# EAGLE design VEML6030 (EAGLE 9.6.2)
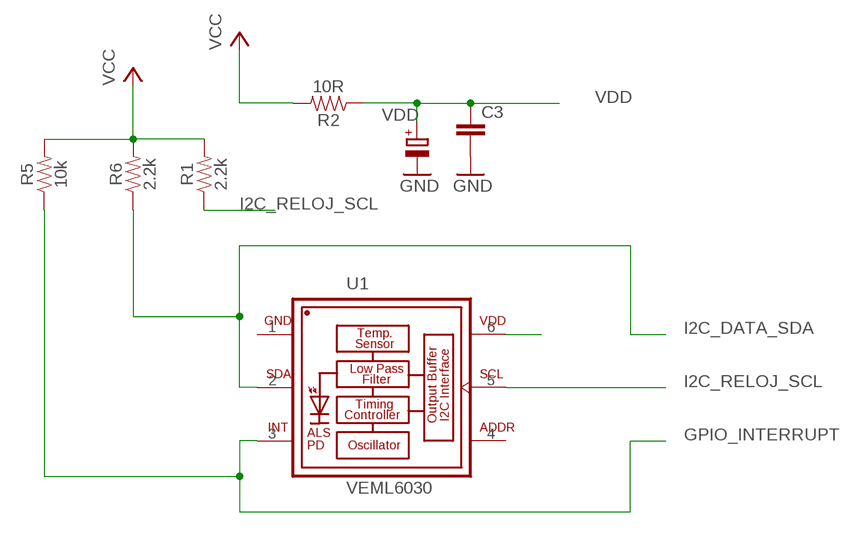
[diagram p0: schematic, sheet 1]

## Parts
C3  CAP-1206  [1206]
R1  2.2k  RESISTOR1206  [1206]
R2  10R  RESISTOR1206  [1206]
R5  10k  RESISTOR1206  [1206]
R6  2.2k  RESISTOR1206  [1206]
U1  VEML6030  [VISHAY_VEML6030_2X2X0.87]

## Nets
GND: C3.2
GPIO_INTERRUPT: R5.1 U1.3(INT)
I2C_DATA_SDA: R6.1 U1.2(SDA)
I2C_RELOJ_SCL: R1.1 U1.5(SCL)
N$1: R2.2
N$2: U1.6(VDD)
VCC: R1.2 R5.2 R6.2
VDD: C3.1 R2.1
Unconnected: U1.4(ADDR)

## Power pins joined to a net without a drawn wire
GND: U1.1(GND)

## Library data of the parts
C3 = SparkFun-Capacitors:CAP
R1 R2 R5 R6 = SparkFun-Resistors:RESISTOR: Generic Resistor Package
U1 = VEML6030:VEML6030: VEML6030 High Accuracy Ambient Light Sensor with I2C Interface: VEML6030 is a high accuracy ambient light digital 16-bit resolution sensor in a miniature transparent 2 mm x 2 mm package. It includes a high sensitive photodiode, a low noise amplifier, a 16-bit A/D converter and supports an easy to use I2C bus communication interface and additional interrupt feature. The ambient light result is as digital value available. Device Model created 15.06.2016 by Johannes Kolb - Vishay Semiconductor GmbH Check availability <https://pricing.snapeda.com/parts/VEML6030/Vishay/view-part?ref=eda>; AVAILABILITY: In Stock; CHECK_PRICES: https://www.snapeda.com/parts/VEML6030/Vishay+Semiconductor+Opto+Division/view-part/?ref=eda; DESCRIPTION: Optical Sensor Ambient 550nm I2C 6-SMD, No Lead; MF: Vishay; MP: VEML6030; PACKAGE: SMD-6 Vishay Semiconductor; PRICE: None; SNAPEDA_LINK: https://www.snapeda.com/parts/VEML6030/Vishay+Semiconductor+Opto+Division/view-part/?ref=snap

## Board
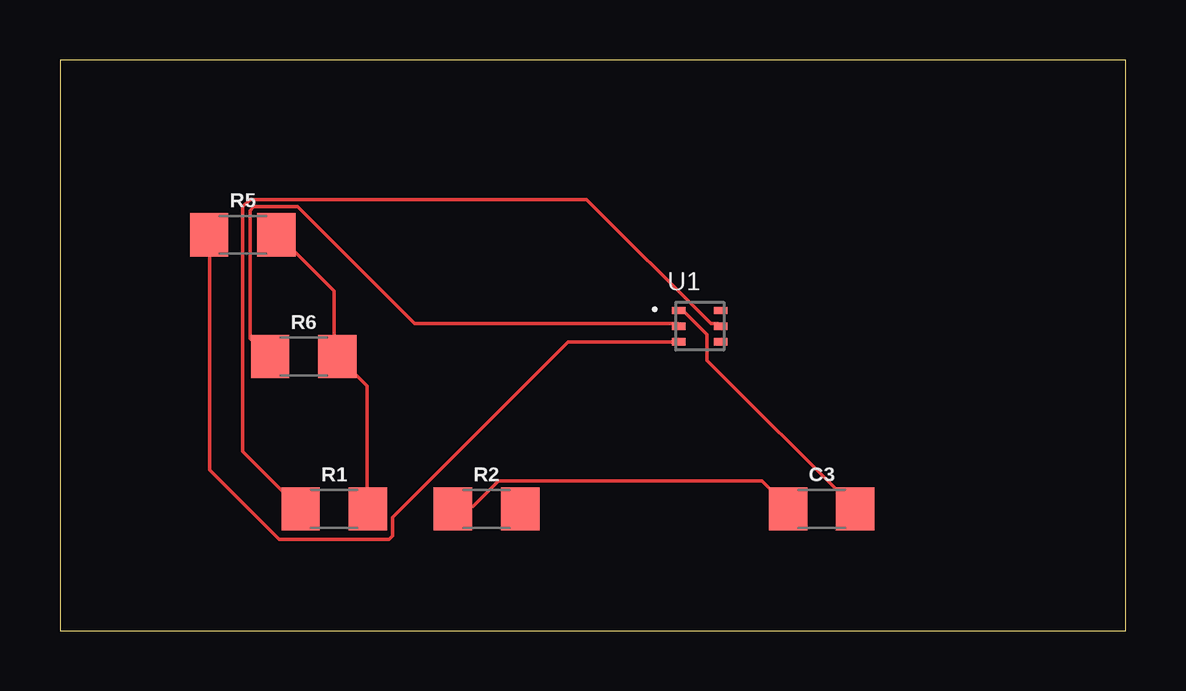
[diagram p1: board, top side]

Size 44.43 x 23.8 mm. Coordinates in mm from the lower left corner, seen from the top.
Outline: 0,0 44.43,0 44.43,23.8 0,23.8 0,0
Copper layers (1*16): Top 0.035mm / dielectric 1.5mm / Bottom 0.035mm
Design rules "default": minimum track width 6mil, minimum drill 0.35mm, track to track 6mil, track to pad 6mil, pad to pad 6mil, via to via 6mil, smd to smd 6mil, copper to edge 40mil, drill to drill 6mil, minimum pad ring 10mil, minimum via ring 8mil, stop-mask expansion 4mil, vias tented up to drill 0mil, thermal gap 10mil

### Footprints (pad centres in the part's own frame; a part is rotated, then mirrored left to right if it is on the bottom)
1206 = smd 1.6 x 1.8: 1 -1.4,0; 2 1.4,0
VISHAY_VEML6030_2X2X0.87 = smd 0.55 x 0.3: 1 -0.875,0.65; 2 -0.875,0; 3 -0.875,-0.65; 4 0.875,-0.65; 5 0.875,0; 6 0.875,0.65

### Placement (x,y rotation side)
C3  31.75,5.08 0 top
R1  11.43,5.08 0 top
R2  17.78,5.08 0 top
R5  7.62,16.51 0 top
R6  10.16,11.43 0 top
U1  26.67,12.7 0 top

### Tracks (layer width: path | path; a pad name or v marks a point on that pad's centre or on a via)
GND
  Top 0.152: U1.1 25.91,13.26 26.06,13.26 26.98,12.34 26.98,11.28 33.07,5.18 C3.2
GPIO_INTERRUPT
  Top 0.152: U1.3 25.76,12.04 21.18,12.04 13.87,4.72 13.87,3.96 13.72,3.81 9.14,3.81 6.25,6.71 6.25,16.46 R5.1
I2C_DATA_SDA
  Top 0.152: U1.2 25.76,12.8 14.78,12.8 9.91,17.68 8.08,17.68 7.92,17.53 7.92,12.19 8.69,11.43 R6.1
I2C_RELOJ_SCL
  Top 0.152: U1.5 27.43,12.8 27.13,12.8 21.95,17.98 7.92,17.98 7.62,17.68 7.62,7.47 9.91,5.18 R1.1
VCC
  Top 0.152: R5.2 9.14,16.46 11.43,14.17 11.43,11.43 R6.2 11.58,11.43 12.8,10.21 12.8,5.18 R1.2
VDD
  Top 0.152: R2.1 16.46,5.18 17.22,5.18 18.29,6.25 29.26,6.25 30.33,5.18 C3.1